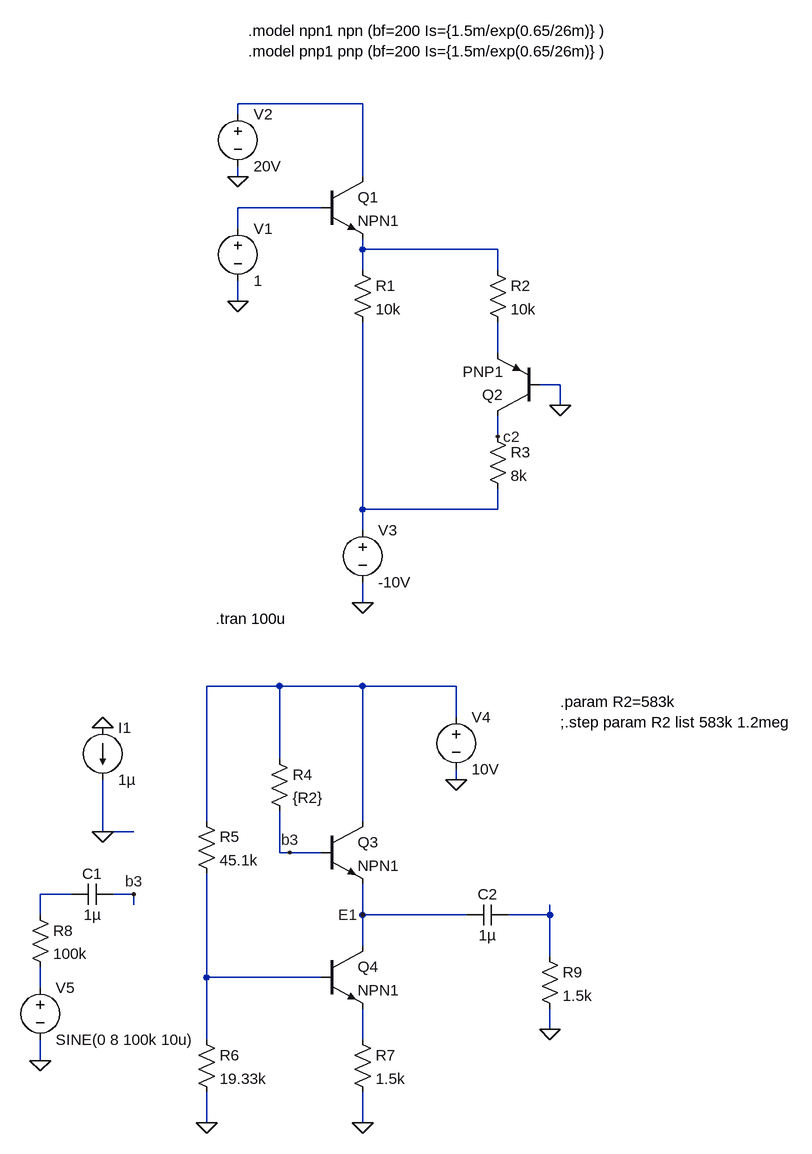
[diagram p0: schematic ws10_11.asc]
ws10_11.asc, the LTspice schematic file:
Version 4
SHEET 1 948 1540
WIRE 224 -48 32 -48
WIRE 32 -32 32 -48
WIRE 32 64 32 48
WIRE 224 64 224 -48
WIRE 160 112 32 112
WIRE 32 144 32 112
WIRE 224 176 224 160
WIRE 432 176 224 176
WIRE 224 208 224 176
WIRE 432 208 432 176
WIRE 32 256 32 224
WIRE 432 336 432 288
WIRE 528 384 496 384
WIRE 528 416 528 384
WIRE 432 464 432 432
WIRE 224 576 224 288
WIRE 432 576 432 544
WIRE 432 576 224 576
WIRE 224 608 224 576
WIRE 224 720 224 688
WIRE 96 848 -16 848
WIRE 224 848 96 848
WIRE 368 848 224 848
WIRE 368 896 368 848
WIRE 96 960 96 848
WIRE 368 992 368 976
WIRE -16 1056 -16 848
WIRE 224 1056 224 848
WIRE -176 1072 -176 992
WIRE -128 1072 -176 1072
WIRE 96 1104 96 1040
WIRE 112 1104 96 1104
WIRE 160 1104 112 1104
WIRE -224 1168 -272 1168
WIRE -128 1168 -160 1168
WIRE -128 1184 -128 1168
WIRE -272 1200 -272 1168
WIRE 224 1200 224 1152
WIRE 384 1200 224 1200
WIRE 512 1200 512 1184
WIRE 512 1200 448 1200
WIRE 224 1248 224 1200
WIRE 512 1264 512 1200
WIRE -16 1296 -16 1136
WIRE 160 1296 -16 1296
WIRE -272 1312 -272 1280
WIRE 512 1376 512 1344
WIRE -16 1392 -16 1296
WIRE 224 1392 224 1344
WIRE -272 1424 -272 1392
WIRE -16 1520 -16 1472
WIRE 224 1520 224 1472
FLAG 224 720 0
FLAG 528 416 0
FLAG 32 256 0
FLAG 32 64 0
FLAG 432 464 c2
FLAG 368 992 0
FLAG -16 1520 0
FLAG 224 1520 0
FLAG 224 1200 E1
FLAG 112 1104 b3
FLAG -176 912 0
FLAG -176 1072 0
FLAG -272 1424 0
FLAG -128 1168 b3
FLAG 512 1376 0
SYMBOL voltage 32 128 R0
SYMATTR InstName V1
SYMATTR Value 1
SYMBOL voltage 32 -48 R0
SYMATTR InstName V2
SYMATTR Value 20V
SYMBOL voltage 224 592 R0
WINDOW 123 0 0 Left 2
WINDOW 39 0 0 Left 2
SYMATTR InstName V3
SYMATTR Value -10V
SYMBOL npn 160 64 R0
SYMATTR InstName Q1
SYMATTR Value NPN1
SYMBOL res 208 192 R0
SYMATTR InstName R1
SYMATTR Value 10k
SYMBOL res 416 192 R0
SYMATTR InstName R2
SYMATTR Value 10k
SYMBOL pnp 496 432 R180
SYMATTR InstName Q2
SYMATTR Value PNP1
SYMBOL res 416 448 R0
SYMATTR InstName R3
SYMATTR Value 8k
SYMBOL npn 160 1056 R0
SYMATTR InstName Q3
SYMATTR Value NPN1
SYMBOL npn 160 1248 R0
SYMATTR InstName Q4
SYMATTR Value NPN1
SYMBOL voltage 368 880 R0
WINDOW 123 0 0 Left 2
WINDOW 39 0 0 Left 2
SYMATTR InstName V4
SYMATTR Value 10V
SYMBOL res 80 944 R0
SYMATTR InstName R4
SYMATTR Value {R2}
SYMBOL res -32 1040 R0
SYMATTR InstName R5
SYMATTR Value 45.1k
SYMBOL res -32 1376 R0
SYMATTR InstName R6
SYMATTR Value 19.33k
SYMBOL res 208 1376 R0
SYMATTR InstName R7
SYMATTR Value 1.5k
SYMBOL current -176 912 R0
WINDOW 123 0 0 Left 2
WINDOW 39 0 0 Left 2
SYMATTR InstName I1
SYMATTR Value 1µ
SYMBOL voltage -272 1296 R0
WINDOW 123 0 0 Left 2
WINDOW 39 0 0 Left 2
SYMATTR InstName V5
SYMATTR Value SINE(0 8 100k 10u)
SYMBOL res -288 1184 R0
SYMATTR InstName R8
SYMATTR Value 100k
SYMBOL res 496 1248 R0
SYMATTR InstName R9
SYMATTR Value 1.5k
SYMBOL cap -224 1152 M90
WINDOW 0 0 32 VBottom 2
WINDOW 3 32 32 VTop 2
SYMATTR InstName C1
SYMATTR Value 1µ
SYMBOL cap 448 1184 R90
WINDOW 0 0 32 VBottom 2
WINDOW 3 32 32 VTop 2
SYMATTR InstName C2
SYMATTR Value 1µ
TEXT 48 -160 Left 2 !.model npn1 npn (bf=200 Is={1.5m/exp(0.65/26m)} )\n.model pnp1 pnp (bf=200 Is={1.5m/exp(0.65/26m)} )
TEXT -2 744 Left 2 !.tran 100u
TEXT 528 872 Left 2 !.param R2=583k\n;.step param R2 list 583k 1.2meg

The netlist it stands for:
* ws10_11.asc
V1 N002 0 1
V2 N001 0 20V
V3 N005 0 -10V
Q1 N001 N002 N003 0 NPN1
R1 N003 N005 10k
R2 N003 N004 10k
Q2 c2 0 N004 0 PNP1
R3 c2 N005 8k
Q3 N006 b3 E1 0 NPN1
Q4 E1 N009 N011 0 NPN1
V4 N006 0 10V
R4 N006 b3 {R2}
R5 N006 N009 45.1k
R6 N009 0 19.33k
R7 N011 0 1.5k
I1 0 0 1µ
V5 N010 0 SINE(0 8 100k 10u)
R8 N007 N010 100k
R9 N008 0 1.5k
C1 N007 b3 1µ
C2 N008 E1 1µ
.model NPN NPN
.model PNP PNP
.lib standard.bjt
.model npn1 npn (bf=200 Is={1.5m/exp(0.65/26m)} )
.model pnp1 pnp (bf=200 Is={1.5m/exp(0.65/26m)} )
.tran 100u
.param R2=583k
;.step param R2 list 583k 1.2meg
.backanno
.end